# Altium schematic sheet MixerHF.SchDoc
size A4
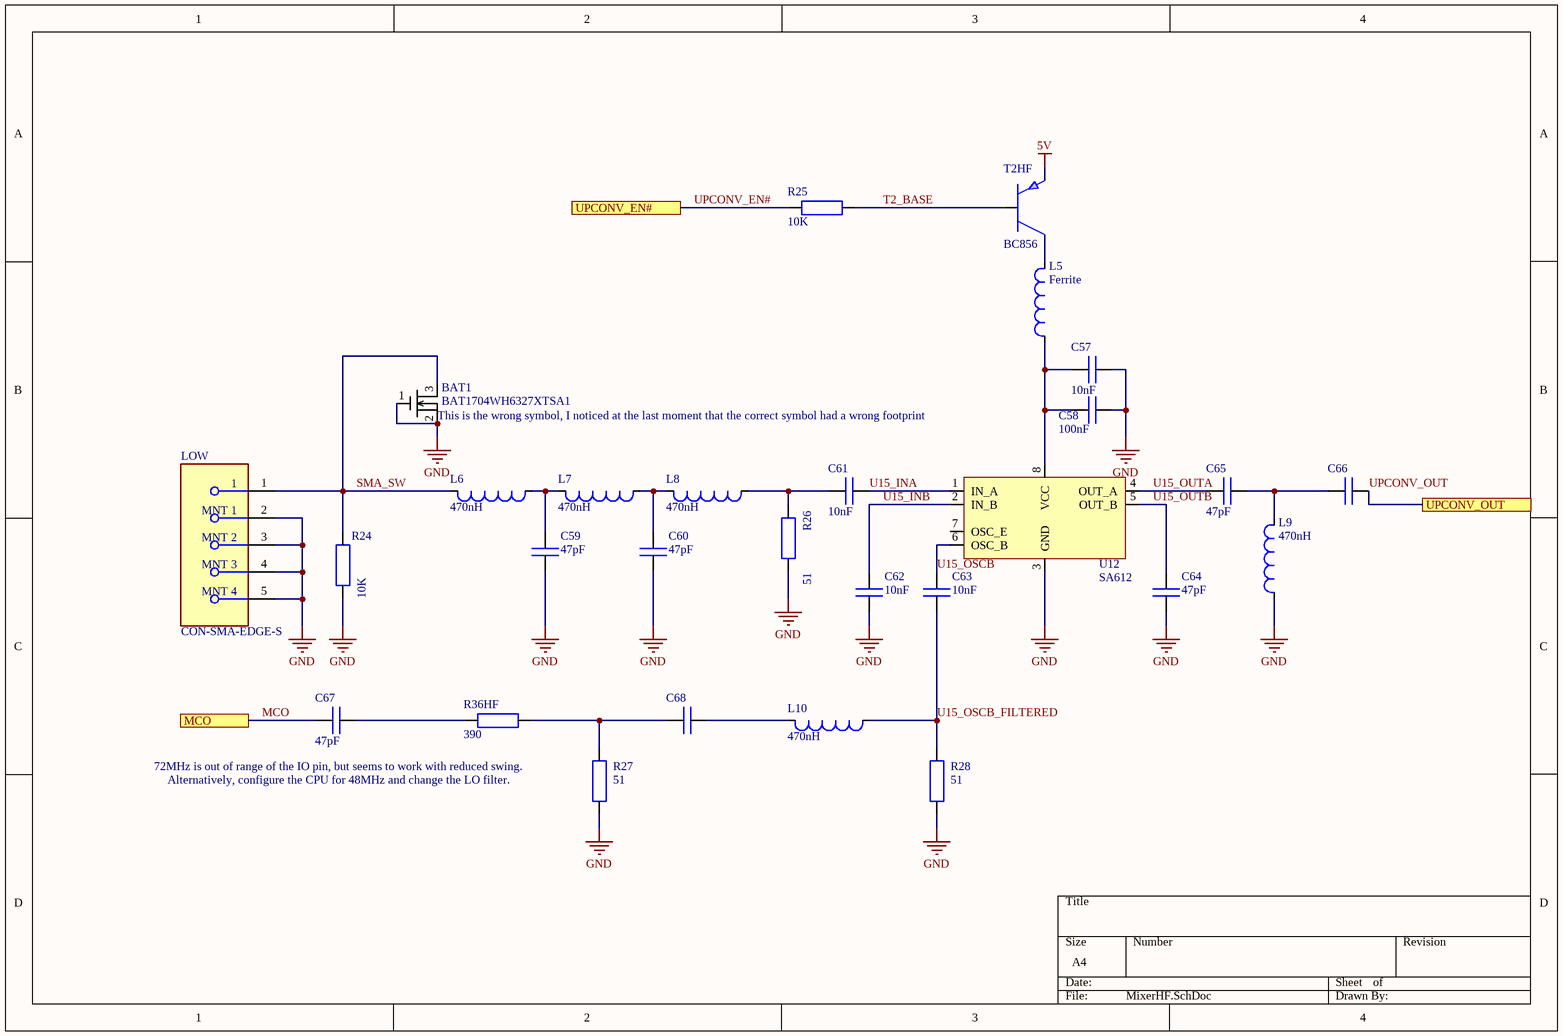
[diagram p0: MixerHF.SchDoc]

## Parts
BAT1  BAT1704WH6327XTSA1  [SOT95P230X110-3N]
C57  10nF  [smd C0603_0.80]
C58  100nF  [smd C0603_0.80]
C59  47pF  [smd C0603_0.80]
C60  47pF  [smd C0603_0.80]
C61  10nF  [smd C0603_0.80]
C62  10nF  [smd C0603_0.80]
C63  10nF  [smd C0603_0.80]
C64  47pF  [smd C0603_0.80]
C65  47pF  [smd C0603_0.80]
C66  (no value)  [smd C0603_0.80]
C67  47pF  [smd C0402]
C68  (no value)  [smd C0603_0.80]
L5  Ferrite  [smd C0805]
L6  470nH  [smd C0805]
L7  470nH  [smd C0805]
L8  470nH  [smd C0805]
L9  470nH  [smd C0805]
L10  470nH  [smd C0805]
LOW  CON-SMA-EDGE-S  [FP-CON-SMA-EDGE-S-MFG]
R24  10K  [smd C0603_0.45]
R25  10K  [smd C0603_0.45]
R26  51  [smd C0603_0.45]
R27  51  [smd C0603_0.45]
R28  51  [smd C0603_0.45]
R36HF  390  [smd C0603_0.45]
T2HF  BC856  [smd SOT-23]
U12  SA612  [SOIC127P600X175-8N]

## Ports
MCO, UPCONV_EN#, UPCONV_OUT

## Nets
5V: T2HF.2
GND: BAT1.1(G) BAT1.2(S) C57.1 C58.1 C59.1 C60.1 C62.2 C64.1 L9.1 LOW.2(MNT_1) LOW.3(MNT_2) LOW.4(MNT_3) LOW.5(MNT_4) R24.1 R26.1 R27.2 R28.2 U12.3(GND)
MCO: C67.2 ; port MCO
SMA_SW: BAT1.3(D) L6.2 LOW.1 R24.2
T2_BASE: R25.2 T2HF.1
U15_INA: C61.1 U12.1(IN_A)
U15_INB: C62.1 U12.2(IN_B)
U15_OSCB: C63.1 U12.6(OSC_B)
U15_OSCB_FILTERED: C63.2 L10.1 R28.1
U15_OUTA: C65.1 U12.4(OUT_A)
U15_OUTB: C64.2 U12.5(OUT_B)
UPCONV_EN#: R25.1 ; port UPCONV_EN#
UPCONV_OUT: C66.2 ; port UPCONV_OUT
NetC57_2: C57.2 C58.2 L5.1 U12.8(VCC)
NetC59_2: C59.2 L6.1 L7.2
NetC60_2: C60.2 L7.1 L8.2
NetC61_2: C61.2 L8.1 R26.2
NetC65_2: C65.2 C66.1 L9.2
NetC67_1: C67.1 R36HF.2
NetC68_1: C68.1 L10.2
NetC68_2: C68.2 R27.1 R36HF.1
NetL5_2: L5.2 T2HF.3

Not connected (* = marked no-connect by the designer): U12 7(OSC_E)

## Notes on the sheet
- (near BAT1) This is the wrong symbol, I noticed at the last moment that the correct symbol had a wrong footprint
- (near R27) 72MHz is out of range of the IO pin, but seems to work with reduced swing.
- (near R27) Alternatively, configure the CPU for 48MHz and change the LO filter.

## Library data of the parts
BAT1 = NX3008NBK
C57 C61-C63 = CSMD603/10nF: smd capaciteit, verp.0603, 10nF; Part Number: CSMD603/10nF; Component Kind: Standard; Component Type: Standard; Pin Count: 2; Supplier 1: Farnell
C58 = CSMD603/100nF: smd capaciteit, verp.0603, 100nF; Part Number: CSMD603/100nF; Component Kind: Standard; Component Type: Standard; Designator: CSMD603/100nF; Pin Count: 2; Supplier 1: Farnell
C59 C60 C64 C65 = CSMD603/47pF: smd capaciteit, verp.0603, 47pF; Part Number: CSMD603/47pF; Component Kind: Standard; Component Type: Standard; Pin Count: 2; Supplier 1: Farnell
C66 C68 = CSMD603/10pF: smd capaciteit, verp.0603, 10pF; Part Number: CSMD603/10pF; Component Kind: Standard; Component Type: Standard; Pin Count: 2; Supplier 1: Farnell
  C66: Designator: CSMD603/10pF
C67 = CSMD402/47pF: smd capaciteit, verp.0402, 47pF; Part Number: CSMD402/47pF; Component Kind: Standard; Component Type: Standard; Pin Count: 2; Supplier 1: Farnell
L5 = Ferrite 0805: Ferrite bead, 0805 package; Supplier 1: Farnell
L6-L10 = SPL805/470nH: smd spoel, verpakking 805, 470nH; Component Kind: Standard; Supplier 1: Farnell
LOW = CMP-204357-000001-1: CONN SMA JACK STR EDGE MNT; Manufacturer: RF Solutions Ltd.; Impedance: 50Ω; Conn Orientation: Right Angle; Is Female: yes; Number Of Contacts: 1; Frequency: 18GHz; Shielding: true; Category: Conn; ComponentLink2URL: https://www.rfsolutions.co.uk/downloads/1498648656DS-CON-EDGE-SMA-4.pdf; Octopart: https://octopart.com/con-sma-edge-s-rf+solutions-70967450; Package: CONN_JACK; Manufacturer Part Number: CON-SMA-EDGE-S; Height: 6.35mm; Device Class L1: Connectors; Footprint Url: https://forum.upverter.com/uploads/default/original/3X/b/e/be75b907af57498775929d6d9099689c472e0307.pdf; Contact Material: Gold; ComponentLink2Description: Datasheet; Device Class L2: RF / Coaxial Connectors; RoHS: TRUE; Device Class L3: unset; Digikey Description: CONN SMA JACK STR EDGE MNT; Lead Free: Yes; Automotive: No
R24 R25 = 10K/603: weerstand SMD603, 10K; Supplier 1: Farnell
R26-R28 = 51R/603: weerstand SMD603, 51R; Supplier 1: Farnell
R36HF = 390R/603: weerstand SMD603, 390R; Supplier 1: Farnell
T2HF = BC856: PNP transistor, smd; Supplier 1: Farnell